# EAGLE design PulseGenerator (EAGLE 7.2.0)
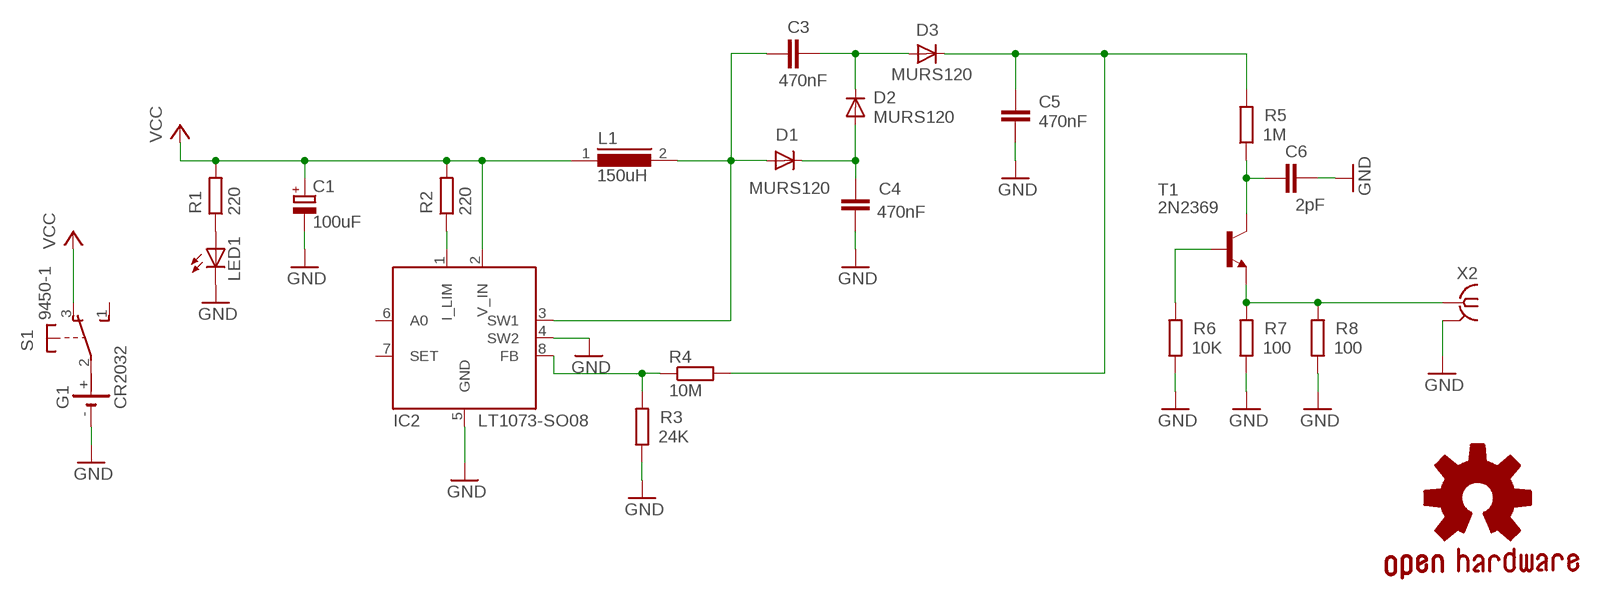
[diagram p0: schematic, sheet 1]

## Parts
C1  100uF  CPOL-EUD/7343-31R  [D/7343-31R]
C3  470nF  C-EUC1206  [C1206]
C4  470nF  C-EUC1206  [C1206]
C5  470nF  C-EUC1206  [C1206]
C6  2pF  C-EUC1206  [C1206]
D1  MURS120  DIODE-DO214AA  [DO214AA]
D2  MURS120  DIODE-DO214AA  [DO214AA]
D3  MURS120  DIODE-DO214AA  [DO214AA]
G1  CR2032  [CR2032SMD]
GOLD_ORB_SM1  OSHWLOGO_GOLD_ORB_SM  [OSHW2]
IC2  LT1073-SO08  [SO08]
L1  150uH  DR125  [DR125]
LED1  LEDCHIPLED_1206  [CHIPLED_1206]
R1  220  R-EU_R1206  [R1206]
R2  220  R-EU_R1206  [R1206]
R3  24K  R-EU_R1206  [R1206]
R4  10M  R-EU_R1206  [R1206]
R5  1M  R-EU_R1206  [R1206]
R6  10K  R-EU_R1206  [R1206]
R7  100  R-EU_R1206  [R1206]
R8  100  R-EU_R1206  [R1206]
S1  9450-1  [9450-1]
T1  2N2369  [TO18]
X2  BU-SMA-H  [BU-SMA-H]

## Nets
GND: C1.- C4.2 C5.2 C6.1 G1.- IC2.4(SW2) IC2.5(GND) LED1.C R3.1 R6.1 R7.1 R8.1 X2.2(GND)
N$1: C4.1 D1.C D2.A
N$2: LED1.A R1.1
N$3: G1.+ S1.2(P)
N$4: C3.1 D2.C D3.A
N$5: IC2.1(I_LIM) R2.1
N$6: C6.2 R5.1 T1.3(C)
N$7: C5.1 D3.C R4.2 R5.2
N$8: C3.2 D1.A IC2.3(SW1) L1.2
N$9: IC2.8(FB) R3.2 R4.1
N$10: R6.2 T1.2(B)
N$11: R7.2 R8.2 T1.1(E) X2.1
VCC: C1.+ IC2.2(V_IN) L1.1 R1.2 R2.2 S1.3(O)
Unconnected: IC2.6(A0) IC2.7(SET) S1.1(S)

## Power pins joined to a net without a drawn wire
GND: X2.3(GND) X2.4(GND) X2.5(GND)

## Library data of the parts
C1 = rcl:CPOL-EU: POLARIZED CAPACITOR, European symbol
C3-C6 = rcl:C-EU: CAPACITOR, European symbol
D1-D3 = diode:DIODE-: DIODE
G1 = own-collection:CR2032: Holder for CR2032 coin cell batteries.
GOLD_ORB_SM1 = bfl:OSHWLOGO: These are Open-Source Hardware logos.
IC2 = lt1073:LT1073-SO08
L1 = inductors:DR125: High Power Density, High Efficiency, Shielded Inductors Source: coiltronics_dr_series.pdf
LED1 = led:LED: LED OSRAM: - CHIPLED LG R971, LG N971, LY N971, LG Q971, LY Q971, LO R971, LY R971 LH N974, LH R974 LS Q976, LO Q976, LY Q976 LO Q996 - Hyper CHIPLED LW Q18S LB Q993, LB Q99A, LB R99A - SideLED LS A670, LO A670, LY A670, LG A670, LP A670 LB A673, LV A673, LT A673, LW A673 LH A674 LY A675 LS A676, LA A676, LO A676, LY A676, LW A676 LS A679, LY A679, LG A679 - Hyper Micro SIDELED® LS Y876, LA Y876, LO Y876, LY Y876 LT Y87S - SmartLED LW L88C, LW L88S LB L89C, LB L89S, LG L890 LS L89K, LO L89K, LY L89K LS L896, LA L896, LO L896, LY L896 - TOPLED LS T670, LO T670, LY T670, LG T670, LP T670 LSG T670, LSP T670, LSY T670, LOP T670, LYG T670 LG T671, LOG T671, LSG T671 LB T673, LV T673, LT T673, LW T673 LH T674 LS T676, LA T676, LO T676, LY T676, LB T676, LH T676, LSB T676, LW T676 LB T67C, LV T67C, LT T67C, LS T67K, LO T67K, LY T67K, LW E67C LS E67B, LA E67B, LO E67B, LY E67B, LB E67C, LV E67C, LT E67C LW T67C LS T679, LY T679, LG T679 LS T770, LO T770, LY T770, LG T770, LP T770 LB T773, LV T773, LT T773, LW T773 LH T774 LS E675, LA E675, LY E675, LS T675 LS T776, LA T776, LO T776, LY T776, LB T776 LHGB T686 LT T68C, LB T68C - Hyper Mini TOPLED® LB M676 - Mini TOPLED Santana® LG M470 LS M47K, LO M47K, LY M47K Source: http://www.osram.convergy.de LUXEON: - LUMILED® LXK2-PW12-R00, LXK2-PW12-S00, LXK2-PW14-U00, LXK2-PW14-V00 LXK2-PM12-R00, LXK2-PM12-S00, LXK2-PM14-U00 LXK2-PE12-Q00, LXK2-PE12-R00, LXK2-PE12-S00, LXK2-PE14-T00, LXK2-PE14-U00 LXK2-PB12-K00, LXK2-PB12-L00, LXK2-PB12-M00, LXK2-PB14-N00, LXK2-PB14-P00, LXK2-PB14-Q00 LXK2-PR12-L00, LXK2-PR12-M00, LXK2-PR14-Q00, LXK2-PR14-R00 LXK2-PD12-Q00, LXK2-PD12-R00, LXK2-PD12-S00 LXK2-PH12-R00, LXK2-PH12-S00 LXK2-PL12-P00, LXK2-PL12-Q00, LXK2-PL12-R00 Source: www.luxeon.com KINGBRIGHT: KA-3528ASYC Source: www.kingbright.com
R1-R8 = rcl:R-EU_: RESISTOR, European symbol
S1 = switch-misc:9450-1: MARQUARDT SWITCH
T1 = transistor-neu-to92:2N2369: NPN TRANSISTOR
X2 = con-coax:BU-SMA-H: FEMALE SMA CONNECTOR Radiall

## Net classes
0 default: drill 0.508 mm, clearance 0.635 mm

## Board
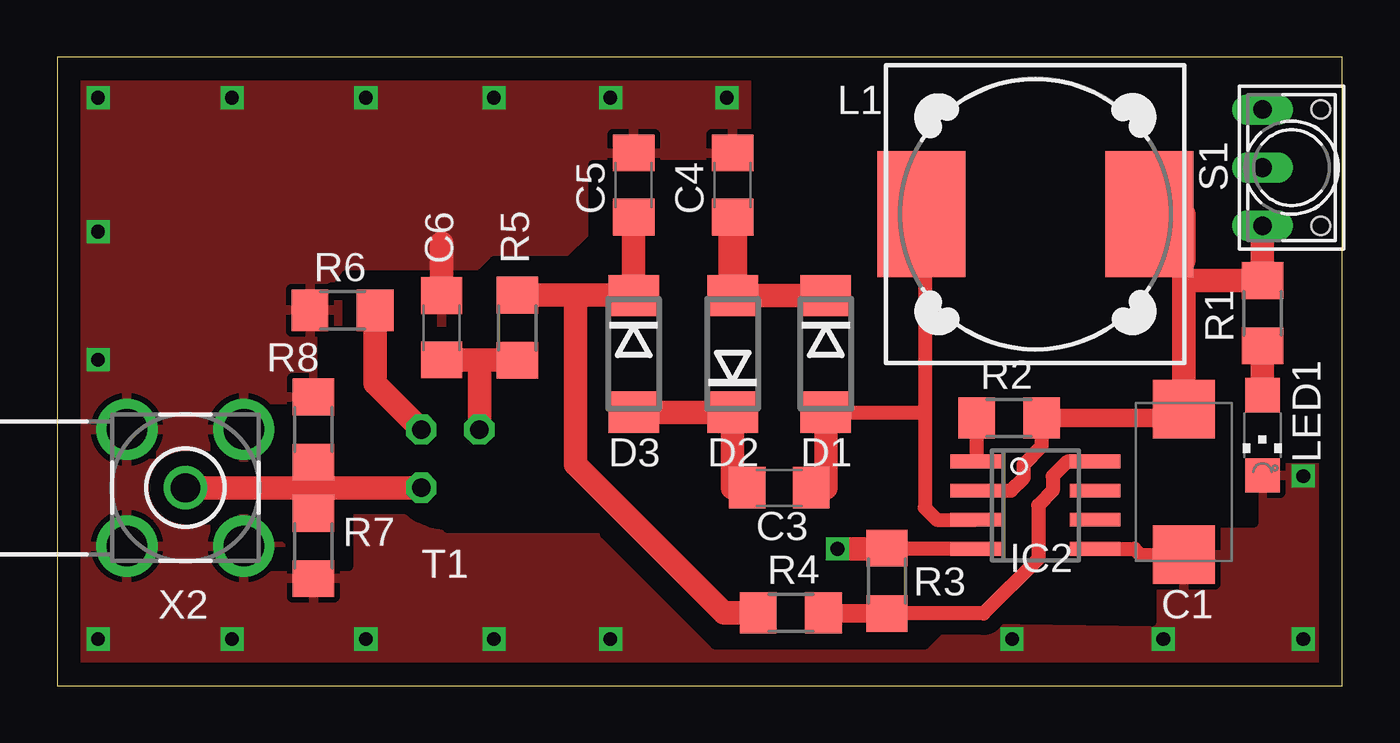
[diagram p1: board, top side]
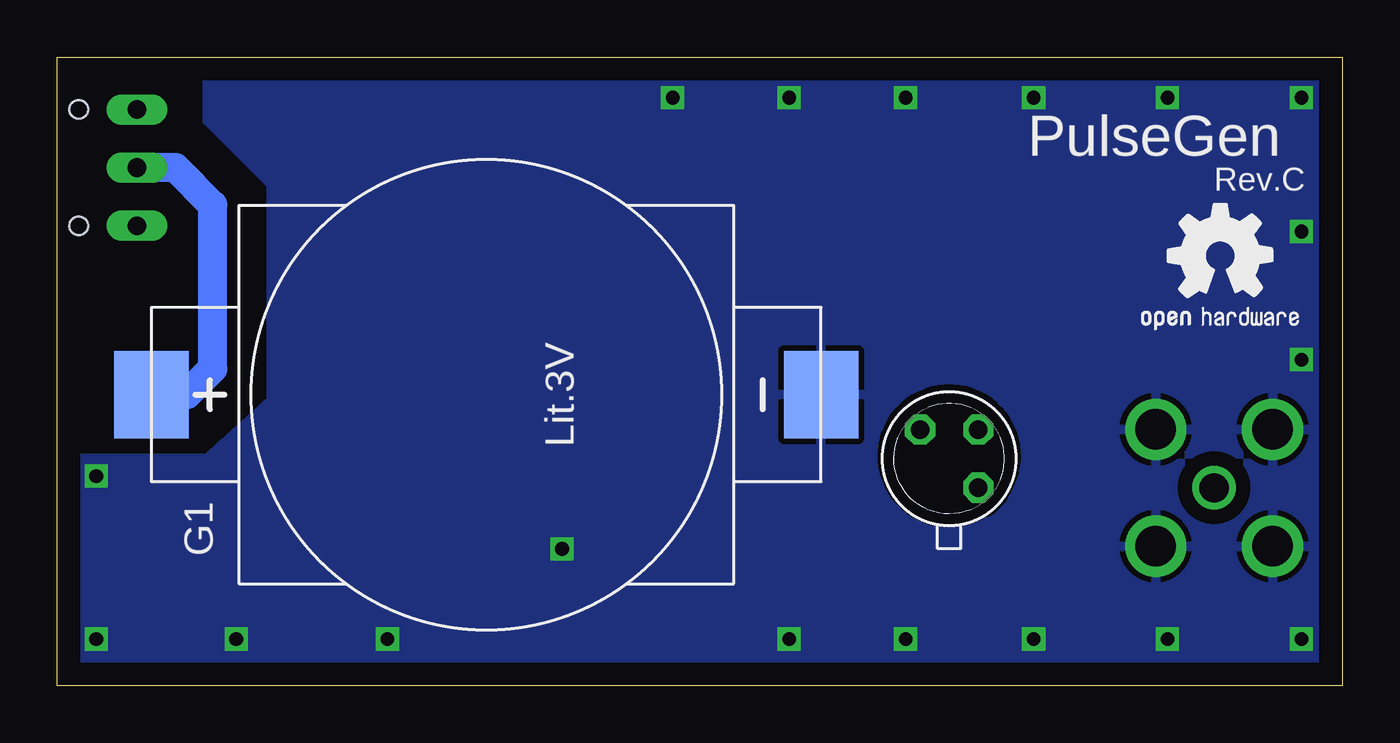
[diagram p2: board, bottom side, seen from below]

Size 56.06 x 27.42 mm. Coordinates in mm from the lower left corner, seen from the top.
Outline: 0,0 56.06,0 56.06,27.42 0,27.42 0,0
Copper layers (1*16): Top 0.035mm / dielectric 1.5mm / Bottom 0.035mm
Design rules "default": minimum track width 10mil, minimum drill 24mil, track to track 8mil, track to pad 8mil, pad to pad 8mil, via to via 8mil, smd to smd 8mil, copper to edge 40mil, drill to drill 8mil, minimum pad ring 10mil, minimum via ring 8mil, stop-mask expansion 4mil, vias tented up to drill 0mil, thermal gap 10mil

### Footprints (pad centres in the part's own frame; a part is rotated, then mirrored left to right if it is on the bottom)
D/7343-31R = smd 2.55 x 2.7: + 3.175,0; - -3.175,0
C1206 = smd 1.6 x 1.8: 1 -1.4,0; 2 1.4,0
DO214AA = smd 1.8 x 2.2: A 2.55,0; C -2.55,0
CR2032SMD = smd 3.81 x 3.251: + 0,14.605; - 0,-14.605
SO08 = smd 0.6 x 2.2: 1 -1.905,-2.6; 2 -0.635,-2.6; 3 0.635,-2.6; 4 1.905,-2.6; 5 1.905,2.6; 6 0.635,2.6; 7 -0.635,2.6; 8 -1.905,2.6
DR125 = smd 3.85 x 5.5: 1 -4.975,0; 2 4.975,0
CHIPLED_1206 = smd 1.5 x 1.5: A 0,-1.75; C 0,1.75
R1206 = smd 1.6 x 1.803: 1 -1.422,0; 2 1.422,0
9450-1 = drill 0.813 long: 1 -2.54,-1.27; 2 0,-1.27; 3 2.54,-1.27 | hole 0.813: 2.54,1.27; -2.54,1.27
TO18 = drill 0.813 octagon: 1 -1.27,-1.27; 2 1.27,-1.27; 3 1.27,1.27
BU-SMA-H = drill 1.27: 1 0,0 | drill 1.778: 2 -2.55,2.55; 3 2.55,2.55; 4 2.55,-2.55; 5 -2.55,-2.55

### Placement (x,y rotation side)
C1  49.15,8.89 90 top
C3  31.5,8.64 0 top
C4  29.46,21.84 90 top
C5  25.15,21.84 90 top
C6  16.76,15.62 270 top
D1  33.53,14.48 270 top
D2  29.46,14.48 90 top
D3  25.15,14.48 270 top
G1  37.34,12.7 90 bottom
GOLD_ORB_SM1  9.14,14.48 0 bottom
IC2  42.67,7.87 270 top
L1  42.67,20.57 180 top
LED1  52.58,10.92 180 top
R1  52.58,16.26 90 top
R2  41.53,11.68 0 top
R3  36.2,4.57 270 top
R4  32,3.18 180 top
R5  20.07,15.62 90 top
R6  12.45,16.38 0 top
R7  11.18,6.1 90 top
R8  11.18,11.18 270 top
S1  53.85,22.61 270 top
T1  17.15,9.91 90 bottom
X2  5.59,8.64 180 top

### Tracks (layer width: path | path; a pad name or v marks a point on that pad's centre or on a via)
GND  (via drill 0.6)
  Top 0.406: 40.15,5.97 IC2.4 39.5,5.97 | 36.2,5.97 R3.1 | C1.- 49.28,5.71
  Top 0.61: IC2.4 36.2,5.97 | IC2.5 46.99,5.97 47.24,5.71 C1.-
  Top 1.016: 36.2,5.97 v34.04,5.97 | C6.1 16.76,19.3
  other vias: 1.78,2.03 1.78,25.65 54.36,2.03 24.13,2.03 24.13,25.65 1.78,14.22 13.46,2.03 13.46,25.65 19.05,25.65 29.21,25.65 54.36,9.14 7.62,25.65 7.62,2.03 19.05,2.03 1.78,19.81 48.26,2.03 41.66,2.03
  pour Top: 0,27.43 0,0 56.13,0 56.13,27.43
  pour Bottom: 0,27.43 0,0 56.13,0 55.88,9.91 49.53,9.91 46.74,12.45 46.74,21.84 49.53,24.64 49.53,27.43
N$1
  Top 1.016: D1.C D2.A
  Top 1.27: C4.1 D2.A
N$2
  Top 1.016: R1.1 LED1.A
N$3
  Bottom 0.813: G1.+ 50.41,12.7
  Bottom 1.27: 50.41,12.7 49.28,13.84 49.28,20.98 50.9,22.61 S1.2
N$4
  Top 1.016: D3.A D2.C 29.46,8.64 C3.1
N$5
  Top 0.406: 40.11,9.78 IC2.1
  Top 0.61: R2.1 40.11,9.78
N$6
  Top 0.406: 20.04,14.22 R5.1
  Top 1.016: C6.2 18.41,14.22 | 18.41,14.22 20.04,14.22 | T1.3 18.41,14.22
N$7
  Top 0.406: 25.13,17.04 D3.C | 22.61,16.79 22.35,17.04
  Top 1.016: C5.1 D3.C | R4.2 29.09,3.18 22.61,9.66 22.61,16.79 | R5.2 22.35,17.04 25.13,17.04
N$8
  Top 0.406: 33.53,11.81 D1.A | L1.2 37.85,20.57
  Top 0.61: D1.A 37.85,11.93 | 37.85,20.57 37.85,11.93 | 37.85,11.93 37.85,7.76 38.37,7.24 IC2.3
  Top 1.016: C3.2 33.53,8.64 D1.A
N$9
  Top 0.406: R3.2 36.2,3.05 | R4.1 33.43,3.15
  Top 0.61: R3.2 40.41,3.15 42.8,5.54 42.8,7.87 43.43,8.51 43.43,9.14 44.07,9.78 IC2.8
  Top 0.813: 33.43,3.15 R3.2
N$10
  Top 1.016: R6.2 13.87,13.18 T1.2
N$11
  Top 1.016: R7.2 11.18,8.64 | 11.18,8.64 R8.2 | X2.1 11.18,8.64 | 11.18,8.64 T1.1
N$12
  cutout Bottom: 14.22,9.91 arc180 20.07,10.16 arc180
N$13
  cutout Top: 14.22,9.91 arc180 20.07,9.91 arc180
N$14
  cutout Top: 30.48,27.43 56.13,27.43 56.13,9.91 52.2,9.91 52.2,7.11 47.75,7.11 47.75,2.79 30.48,3.05 30.48,12.7 23.37,12.7 23.37,22.73 30.48,22.73
N$15
  cutout Top: 17.02,6.86 23.88,6.86 23.88,13.72 17.02,13.72
N$26
  cutout Top: 28.19,2.79 29.21,1.78 37.85,1.78 38.86,2.79
N$27
  cutout Top: 12.7,15.49 12.7,5.21 9.53,5.21 9.53,5.84 10.16,5.84 10.16,11.18 9.4,11.18 9.4,12.07 11.56,12.07 11.56,15.49
N$28
  cutout Top: 11.94,17.4 12.19,17.4 12.57,17.91 22.61,17.91 22.61,17.02 11.94,17.02
N$29
  cutout Top: 18.54,18.03 19.05,18.54 22.35,18.54 23.37,19.56 23.37,22.61 24.13,22.61 24.13,17.78 18.54,17.78
N$30
  cutout Top: 29.21,1.78 28.7,1.78 23.88,6.6 23.88,6.86 29.21,6.86
N$31
  cutout Top: 7.62,7.24 5.59,7.24 5.59,10.03 7.62,10.03
VCC
  Top 0.406: C1.+ 49.15,11.68 | 49.15,18.44 49.15,18.54 | 49.25,17.68 49.15,17.78
  Top 0.61: IC2.2 41.61,8.51 42.16,9.07 42.16,9.65 42.95,10.46 R2.2
  Top 0.813: 49.15,11.68 R2.2 | 49.15,18.54 49.15,17.78
  Top 1.016: L1.1 49.15,20.57 49.15,18.54 | 49.15,17.78 C1.+ | S1.3 R1.2 49.25,17.68

### Text on the board
bNames: PulseGen | Rev.C